# Altium schematic sheet PS_DDR.SchDoc: RFSOC_AMC
size 420 x 297 mm; Author: G.Kasprowicz; CompanyName: WUT ISE; DrawnBy: G.Kasprowicz; Organization: WUT ISE; Address1: PW ISE; Address2: Nowowiejska 15/19 00-665 Warsaw; Address3: gkasprow@gmail.com; DocumentNumber: 19; Revision: 2; SheetNumber: 20; SheetTotal: 54; ModifiedBy: -; CheckedDate: -; Title2: 8 channel ADC & DAC; DivGrp: WUT ISE; Designer: G.Kasprowicz; ModifiedDate: -; ProjectName: Sensor Box
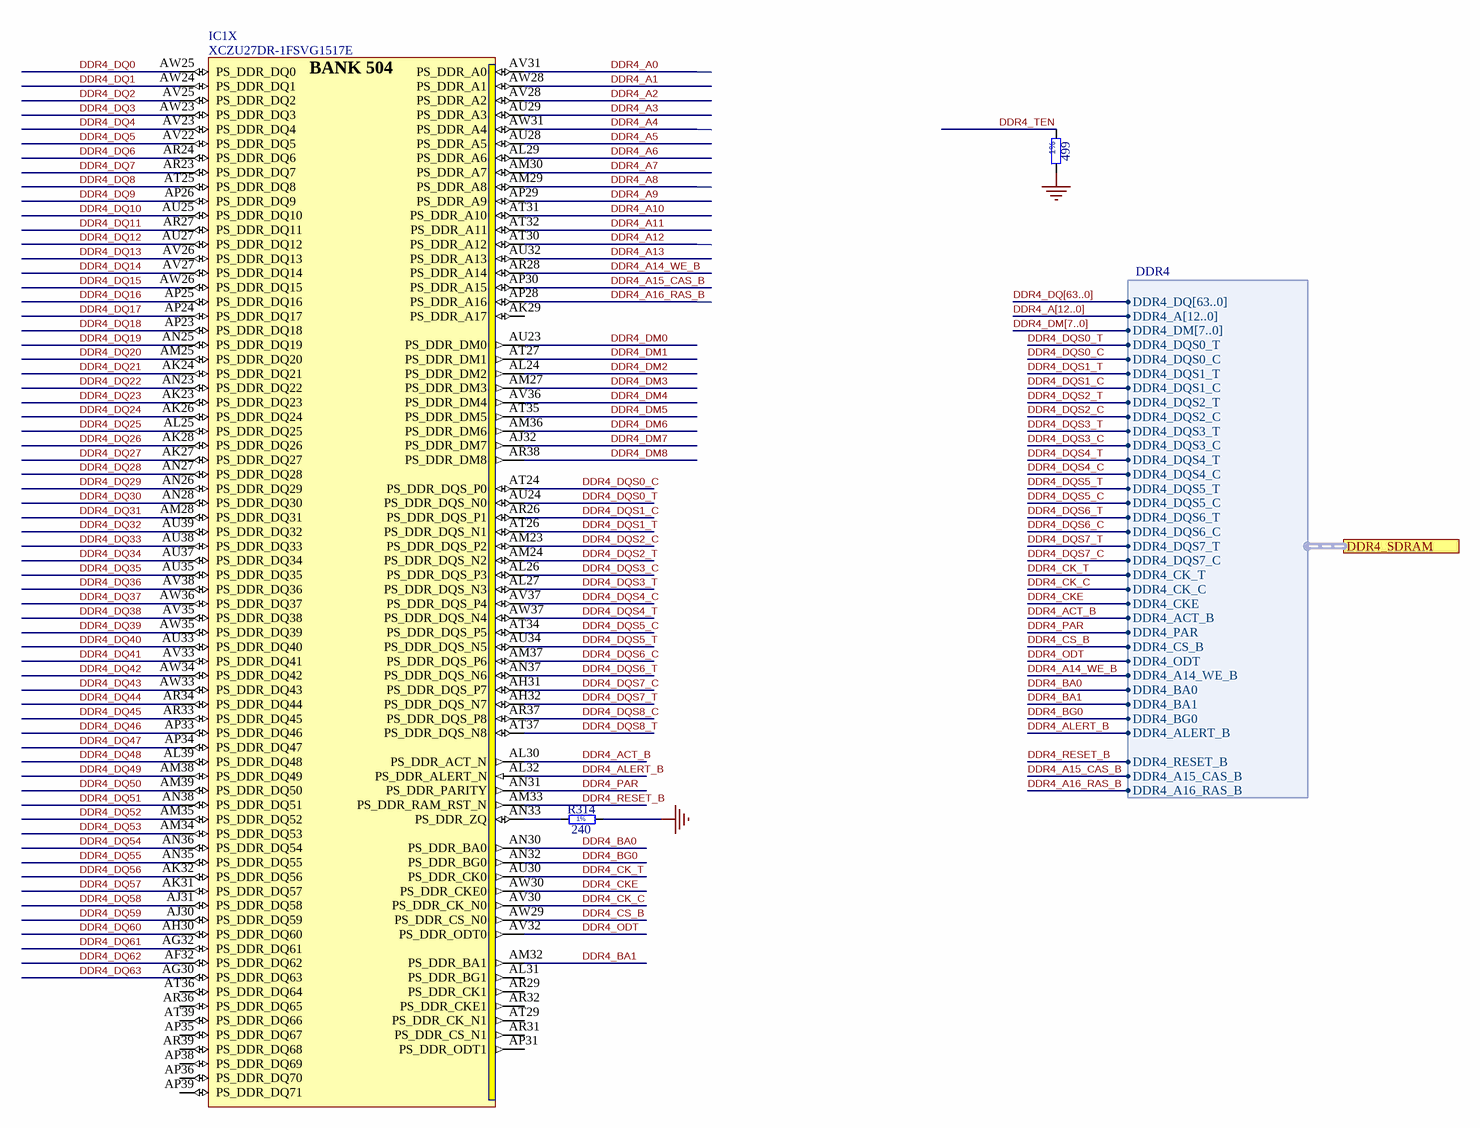
[diagram p0: PS_DDR.SchDoc]

## Parts
IC1  XCZU27DR-1FSVG1517E  [XILINX_FSVG1517 (XCZU27DR)]  (part X of 31)
R314  240  [RESC1005X40N]
R629  499

## Ports
DDR4_SDRAM (harness DDR4)

## Harnesses
DDR4: DDR4_DQ[63..0], DDR4_A[12..0], DDR4_DM[7..0], DDR4_DQS0_T, DDR4_DQS0_C, DDR4_DQS1_T, DDR4_DQS1_C, DDR4_DQS2_T, DDR4_DQS2_C, DDR4_DQS3_T, DDR4_DQS3_C, DDR4_DQS4_T, DDR4_DQS4_C, DDR4_DQS5_T, DDR4_DQS5_C, DDR4_DQS6_T, DDR4_DQS6_C, DDR4_DQS7_T, DDR4_DQS7_C, DDR4_CK_T, DDR4_CK_C, DDR4_CKE, DDR4_ACT_B, DDR4_PAR, DDR4_CS_B, DDR4_ODT, DDR4_A14_WE_B, DDR4_BA0, DDR4_BA1, DDR4_BG0, DDR4_ALERT_B, DDR4_RESET_B, DDR4_A15_CAS_B, DDR4_A16_RAS_B

## Nets
GND: R314.2 R629.1
DDR4_A0: IC1.AV31(PS_DDR_A0)
DDR4_A1: IC1.AW28(PS_DDR_A1)
DDR4_A2: IC1.AV28(PS_DDR_A2)
DDR4_A3: IC1.AU29(PS_DDR_A3)
DDR4_A4: IC1.AW31(PS_DDR_A4)
DDR4_A5: IC1.AU28(PS_DDR_A5)
DDR4_A6: IC1.AL29(PS_DDR_A6)
DDR4_A7: IC1.AM30(PS_DDR_A7)
DDR4_A8: IC1.AM29(PS_DDR_A8)
DDR4_A9: IC1.AP29(PS_DDR_A9)
DDR4_A10: IC1.AT31(PS_DDR_A10)
DDR4_A11: IC1.AT32(PS_DDR_A11)
DDR4_A12: IC1.AT30(PS_DDR_A12)
DDR4_A13: IC1.AU32(PS_DDR_A13)
DDR4_A14_WE_B: IC1.AR28(PS_DDR_A14) ; port DDR4_SDRAM.DDR4_A14_WE_B
DDR4_A15_CAS_B: IC1.AP30(PS_DDR_A15) ; port DDR4_SDRAM.DDR4_A15_CAS_B
DDR4_A16_RAS_B: IC1.AP28(PS_DDR_A16) ; port DDR4_SDRAM.DDR4_A16_RAS_B
DDR4_ACT_B: IC1.AL30(PS_DDR_ACT_N) ; port DDR4_SDRAM.DDR4_ACT_B
DDR4_ALERT_B: IC1.AL32(PS_DDR_ALERT_N) ; port DDR4_SDRAM.DDR4_ALERT_B
DDR4_BA0: IC1.AN30(PS_DDR_BA0) ; port DDR4_SDRAM.DDR4_BA0
DDR4_BA1: IC1.AM32(PS_DDR_BA1) ; port DDR4_SDRAM.DDR4_BA1
DDR4_BG0: IC1.AN32(PS_DDR_BG0) ; port DDR4_SDRAM.DDR4_BG0
DDR4_CK_C: IC1.AV30(PS_DDR_CK_N0) ; port DDR4_SDRAM.DDR4_CK_C
DDR4_CK_T: IC1.AU30(PS_DDR_CK0) ; port DDR4_SDRAM.DDR4_CK_T
DDR4_CKE: IC1.AW30(PS_DDR_CKE0) ; port DDR4_SDRAM.DDR4_CKE
DDR4_CS_B: IC1.AW29(PS_DDR_CS_N0) ; port DDR4_SDRAM.DDR4_CS_B
DDR4_DM0: IC1.AU23(PS_DDR_DM0)
DDR4_DM1: IC1.AT27(PS_DDR_DM1)
DDR4_DM2: IC1.AL24(PS_DDR_DM2)
DDR4_DM3: IC1.AM27(PS_DDR_DM3)
DDR4_DM4: IC1.AV36(PS_DDR_DM4)
DDR4_DM5: IC1.AT35(PS_DDR_DM5)
DDR4_DM6: IC1.AM36(PS_DDR_DM6)
DDR4_DM7: IC1.AJ32(PS_DDR_DM7)
DDR4_DM8: IC1.AR38(PS_DDR_DM8)
DDR4_DQ0: IC1.AW25(PS_DDR_DQ0)
DDR4_DQ1: IC1.AW24(PS_DDR_DQ1)
DDR4_DQ2: IC1.AV25(PS_DDR_DQ2)
DDR4_DQ3: IC1.AW23(PS_DDR_DQ3)
DDR4_DQ4: IC1.AV23(PS_DDR_DQ4)
DDR4_DQ5: IC1.AV22(PS_DDR_DQ5)
DDR4_DQ6: IC1.AR24(PS_DDR_DQ6)
DDR4_DQ7: IC1.AR23(PS_DDR_DQ7)
DDR4_DQ8: IC1.AT25(PS_DDR_DQ8)
DDR4_DQ9: IC1.AP26(PS_DDR_DQ9)
DDR4_DQ10: IC1.AU25(PS_DDR_DQ10)
DDR4_DQ11: IC1.AR27(PS_DDR_DQ11)
DDR4_DQ12: IC1.AU27(PS_DDR_DQ12)
DDR4_DQ13: IC1.AV26(PS_DDR_DQ13)
DDR4_DQ14: IC1.AV27(PS_DDR_DQ14)
DDR4_DQ15: IC1.AW26(PS_DDR_DQ15)
DDR4_DQ16: IC1.AP25(PS_DDR_DQ16)
DDR4_DQ17: IC1.AP24(PS_DDR_DQ17)
DDR4_DQ18: IC1.AP23(PS_DDR_DQ18)
DDR4_DQ19: IC1.AN25(PS_DDR_DQ19)
DDR4_DQ20: IC1.AM25(PS_DDR_DQ20)
DDR4_DQ21: IC1.AK24(PS_DDR_DQ21)
DDR4_DQ22: IC1.AN23(PS_DDR_DQ22)
DDR4_DQ23: IC1.AK23(PS_DDR_DQ23)
DDR4_DQ24: IC1.AK26(PS_DDR_DQ24)
DDR4_DQ25: IC1.AL25(PS_DDR_DQ25)
DDR4_DQ26: IC1.AK28(PS_DDR_DQ26)
DDR4_DQ27: IC1.AK27(PS_DDR_DQ27)
DDR4_DQ28: IC1.AN27(PS_DDR_DQ28)
DDR4_DQ29: IC1.AN26(PS_DDR_DQ29)
DDR4_DQ30: IC1.AN28(PS_DDR_DQ30)
DDR4_DQ31: IC1.AM28(PS_DDR_DQ31)
DDR4_DQ32: IC1.AU39(PS_DDR_DQ32)
DDR4_DQ33: IC1.AU38(PS_DDR_DQ33)
DDR4_DQ34: IC1.AU37(PS_DDR_DQ34)
DDR4_DQ35: IC1.AU35(PS_DDR_DQ35)
DDR4_DQ36: IC1.AV38(PS_DDR_DQ36)
DDR4_DQ37: IC1.AW36(PS_DDR_DQ37)
DDR4_DQ38: IC1.AV35(PS_DDR_DQ38)
DDR4_DQ39: IC1.AW35(PS_DDR_DQ39)
DDR4_DQ40: IC1.AU33(PS_DDR_DQ40)
DDR4_DQ41: IC1.AV33(PS_DDR_DQ41)
DDR4_DQ42: IC1.AW34(PS_DDR_DQ42)
DDR4_DQ43: IC1.AW33(PS_DDR_DQ43)
DDR4_DQ44: IC1.AR34(PS_DDR_DQ44)
DDR4_DQ45: IC1.AR33(PS_DDR_DQ45)
DDR4_DQ46: IC1.AP33(PS_DDR_DQ46)
DDR4_DQ47: IC1.AP34(PS_DDR_DQ47)
DDR4_DQ48: IC1.AL39(PS_DDR_DQ48)
DDR4_DQ49: IC1.AM38(PS_DDR_DQ49)
DDR4_DQ50: IC1.AM39(PS_DDR_DQ50)
DDR4_DQ51: IC1.AN38(PS_DDR_DQ51)
DDR4_DQ52: IC1.AM35(PS_DDR_DQ52)
DDR4_DQ53: IC1.AM34(PS_DDR_DQ53)
DDR4_DQ54: IC1.AN36(PS_DDR_DQ54)
DDR4_DQ55: IC1.AN35(PS_DDR_DQ55)
DDR4_DQ56: IC1.AK32(PS_DDR_DQ56)
DDR4_DQ57: IC1.AK31(PS_DDR_DQ57)
DDR4_DQ58: IC1.AJ31(PS_DDR_DQ58)
DDR4_DQ59: IC1.AJ30(PS_DDR_DQ59)
DDR4_DQ60: IC1.AH30(PS_DDR_DQ60)
DDR4_DQ61: IC1.AG32(PS_DDR_DQ61)
DDR4_DQ62: IC1.AF32(PS_DDR_DQ62)
DDR4_DQ63: IC1.AG30(PS_DDR_DQ63)
DDR4_DQS0_C: IC1.AT24(PS_DDR_DQS_P0) ; port DDR4_SDRAM.DDR4_DQS0_C
DDR4_DQS0_T: IC1.AU24(PS_DDR_DQS_N0) ; port DDR4_SDRAM.DDR4_DQS0_T
DDR4_DQS1_C: IC1.AR26(PS_DDR_DQS_P1) ; port DDR4_SDRAM.DDR4_DQS1_C
DDR4_DQS1_T: IC1.AT26(PS_DDR_DQS_N1) ; port DDR4_SDRAM.DDR4_DQS1_T
DDR4_DQS2_C: IC1.AM23(PS_DDR_DQS_P2) ; port DDR4_SDRAM.DDR4_DQS2_C
DDR4_DQS2_T: IC1.AM24(PS_DDR_DQS_N2) ; port DDR4_SDRAM.DDR4_DQS2_T
DDR4_DQS3_C: IC1.AL26(PS_DDR_DQS_P3) ; port DDR4_SDRAM.DDR4_DQS3_C
DDR4_DQS3_T: IC1.AL27(PS_DDR_DQS_N3) ; port DDR4_SDRAM.DDR4_DQS3_T
DDR4_DQS4_C: IC1.AV37(PS_DDR_DQS_P4) ; port DDR4_SDRAM.DDR4_DQS4_C
DDR4_DQS4_T: IC1.AW37(PS_DDR_DQS_N4) ; port DDR4_SDRAM.DDR4_DQS4_T
DDR4_DQS5_C: IC1.AT34(PS_DDR_DQS_P5) ; port DDR4_SDRAM.DDR4_DQS5_C
DDR4_DQS5_T: IC1.AU34(PS_DDR_DQS_N5) ; port DDR4_SDRAM.DDR4_DQS5_T
DDR4_DQS6_C: IC1.AM37(PS_DDR_DQS_P6) ; port DDR4_SDRAM.DDR4_DQS6_C
DDR4_DQS6_T: IC1.AN37(PS_DDR_DQS_N6) ; port DDR4_SDRAM.DDR4_DQS6_T
DDR4_DQS7_C: IC1.AH31(PS_DDR_DQS_P7) ; port DDR4_SDRAM.DDR4_DQS7_C
DDR4_DQS7_T: IC1.AH32(PS_DDR_DQS_N7) ; port DDR4_SDRAM.DDR4_DQS7_T
DDR4_DQS8_C: IC1.AR37(PS_DDR_DQS_P8)
DDR4_DQS8_T: IC1.AT37(PS_DDR_DQS_N8)
DDR4_ODT: IC1.AV32(PS_DDR_ODT0) ; port DDR4_SDRAM.DDR4_ODT
DDR4_PAR: IC1.AN31(PS_DDR_PARITY) ; port DDR4_SDRAM.DDR4_PAR
DDR4_RESET_B: IC1.AM33(PS_DDR_RAM_RST_N) ; port DDR4_SDRAM.DDR4_RESET_B
DDR4_TEN: R629.2
NetIC1_AN33: IC1.AN33(PS_DDR_ZQ) R314.1

Not connected (* = marked no-connect by the designer): IC1 AK29(PS_DDR_A17) AL31(PS_DDR_BG1) AP31(PS_DDR_ODT1) AP35(PS_DDR_DQ67) AP36(PS_DDR_DQ70) AP38(PS_DDR_DQ69) AP39(PS_DDR_DQ71) AR29(PS_DDR_CK1) AR31(PS_DDR_CS_N1) AR32(PS_DDR_CKE1) AR36(PS_DDR_DQ65) AR39(PS_DDR_DQ68) AT29(PS_DDR_CK_N1) AT36(PS_DDR_DQ64) AT39(PS_DDR_DQ66)

## Buses and harness runs
bus DDR4_A[12..0]
bus DDR4_DM[7..0]
bus DDR4_DQ[63..0]

## Notes on the sheet
- Project/Equipment
- Document
- Designer
- Drawn by
- Check.by
- Copyright WUT ISE 2019.
  This documentation describes Open Hardware and is licensed under the CERN OHL v.1.1. You may redistribute and modify this documentation under the terms of the CERN OHL v.1.1. (http://ohwr.org/CERNOHL). This documentation is distributed WITHOUT ANY EXPRESS OR IMPLIED WARRANTY, INCLUDING OF MERCHANTABILITY, SATISFACTORY QUALITY AND FITNESS FOR A PARTICULAR PURPOSE. Please see the CERN OHL v.1.1 for applicable conditions.
- Contact
- File
- Last Mod.
- Print Date
- Sheet
- Size
- A3
- of
- Rev
- (in symbol R0402_240R_1%_0.0625W_100PPM) 1%
- (in symbol R629) 1%
- (in symbol XCZU27DR-1FSVG1517E, part X) BANK 504

## Library data of the parts
IC1 = XCZU27DR-1FSVG1517E: Zynq UltraScale+ RFSoC, Quad-Core ARM® Cortex™-A53 MPCore™ up to 1.5GHz, 214 PS I/O, 299 HP I/O, 48 HD I/O, 1517-Pin BGA; Manufacturer: XILINX; PressFit: No; Bonding: No; Part Number: XCZU27DR-1FSVG1517E; Component Kind: Standard; Component Type: Standard; Device: XCZU27DR-1FSVG1517E; PackageDescription: BGA, 1.00mm Pitch, Square; 1517 Pin, 39 Columns X 39 Rows, 40.00mm X 40.00mm X 4.01mm H; Part Description: Zynq UltraScale+ RFSoC, Quad-Core ARM® Cortex™-A53 MPCore™ up to 1.5GHz, 214 PS I/O, 299 HP I/O, 48 HD I/O, 1517-Pin BGA; Manufacturer Part Number: XCZU27DR-1FSVG1517E; Pin Count: 1517; Case: BGA1517; Mounted: Yes; Socket: No; SMD: Yes; Sense: No; ComponentHeight: 4.01mm; HelpURL: \\cern.ch\dfs\Applications\Altium\Datasheets\XCZU27DR-1FSVG1517E.pdf; ComponentLink1URL: \\cern.ch\dfs\Applications\Altium\Datasheets\XCZU27DR-1FSVG1517E_Package-Pinout.pdf; ComponentLink1Description: Package/Pinout; ComponentLink2URL: \\cern.ch\dfs\Applications\Altium\Datasheets\XCZU27DR-1FSVG1517E_Pinout.pdf; ComponentLink2Description: Pinout; Author: CERN DEM MR; CreateDate: 02/05/2018; LatestRevisionDate: 02/05/2018
R314 = R0402_240R_1%_0.0625W_100PPM: Resistor - 1%; Manufacturer: GENERIC; Part Description: General Purpose Thick Film Chip Resistor; Manufacturer1 Part Number: 232270672401L; TC: ±100ppm/°C; PressFit: No; Manufacturer Part Number: R0402_240R_1%_0.0625W_100PPM; Part Number: R0402_240R_1%_0.0625W_100PPM; Tolerance: ±1%; Value: 240; Component Kind: Standard; Component Type: Standard; Pin Count: 2; Status: Not Recommended; Power: 0.0625W; Case: 0402; Mounted: Yes; Sense: No; Socket: No; SMD: Yes; Manufacturer1 Example: YAGEO PHYCOMP; Manufacturer1 ComponentHeight: 0.4mm; HelpURL: \\cern.ch\dfs\Applications\Altium\Datasheets\R0402_Phycomp_RC0402.pdf; Author: CERN DEM JLC; CreateDate: 03/12/2007; LatestRevisionDate: 17/10/2012
R629 = (no symbol name): $$NotCommonProperty_General Part Number: R0402_499R_1%_0.063W_100PPM; $$NotCommonProperty_Manufacturer1 Example: YAGEO PHYCOMP; $$NotCommonProperty_Manufacturer1 Part Number: RC0402FR-07499RL; Manufacturer Part Number: R0402_499R_1%_0.0625W_100PPM; Manufacturer: GENERIC; Part Description: General Purpose Thick Film Chip Resistor; Part Name: Resistor - 1% RESC1005X40N; $$Internal_Resolution: 00001mm; $$NotCommonProperty_Case: 0402; $$NotCommonProperty_Pin Count: 2; $$NotCommonProperty_Power: 0.0625W; $$NotCommonProperty_Sense: No; $$NotCommonProperty_SMD: Yes; $$NotCommonProperty_TC: ±100ppm/°C; Cell Name: RESC1005X40N; CmpIndex: 355; DXDB_LIBNAME: Resistors SMD; Ref Designator: R629; SymIndex: 317; Tolerance: ±1%; $$Internal___BlkDate: 18:43:16_11-19-16; $$NotCommonProperty_Manufacturer1 ComponentHeight: 0.4mm; Part Number: Resistor - 1% RESC1005X40N; Value: 499; Orientation: 1 = 1